# Altium schematic sheet 100_POWER.SchDoc: Power Regulation
size A; Revision: 1; SheetNumber: 1
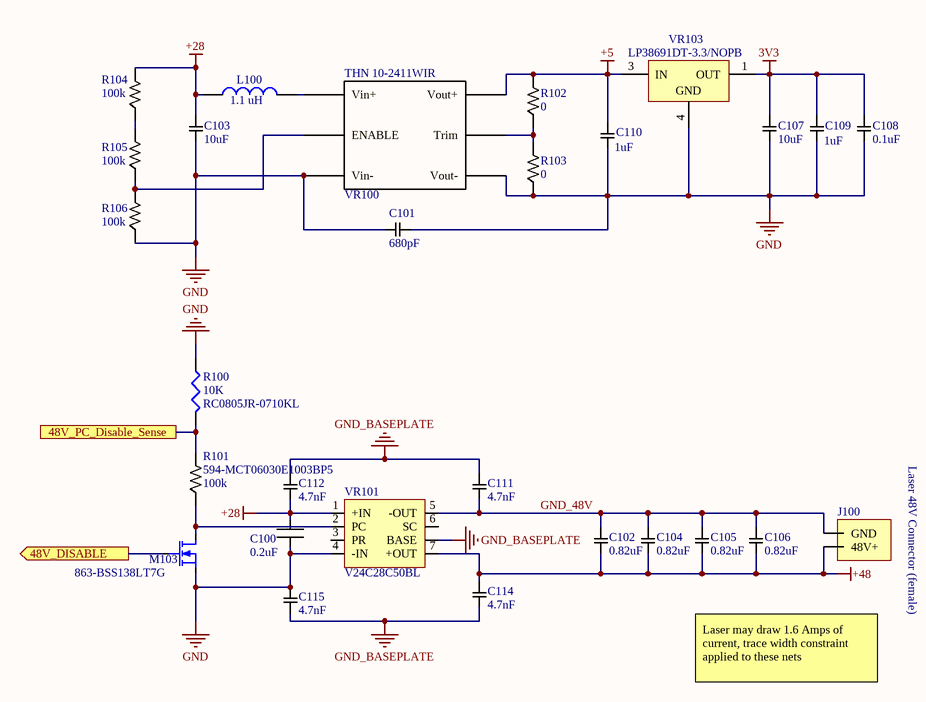
[diagram p0: 100_POWER.SchDoc]

## Parts
C100  value 0.2uF  [CAA572C0G2J204J640LH]  (hidden comment: 0.2uF Capactor, high voltage)
C101  value 680pF  [Imperial1808_CAP]  (hidden comment: 680pF Cap)
C102  value 0.82uF  [IMPERIAL1206_CAPACITOR]  (hidden comment: C1206X824J1RACAUTO)
C103  value 10uF  [Imperial1210_Cap]  (hidden comment: 10uF Capacitor)
C104  value 0.82uF  [IMPERIAL1206_CAPACITOR]  (hidden comment: C1206X824J1RACAUTO)
C105  value 0.82uF  [IMPERIAL1206_CAPACITOR]  (hidden comment: C1206X824J1RACAUTO)
C106  value 0.82uF  [IMPERIAL1206_CAPACITOR]  (hidden comment: C1206X824J1RACAUTO)
C107  value 10uF  [IMPERIAL1206_CAPACITOR]  (hidden comment: C1206X106K8RACAUTO)
C108  value 0.1uF  [IMPERIAL0603_Capacitor]  (hidden comment: 0.1uF Capacitor)
C109  value 1uF  [IMPERIAL0603_Capacitor]  (hidden comment: 1 uF Capacitor)
C110  value 1uF  [IMPERIAL0603_Capacitor]  (hidden comment: 1 uF Capacitor)
C111  value 4.7nF  [IMPERIAL0603_Capacitor]  (hidden comment: 4.7nF Capacitor)
C112  value 4.7nF  [IMPERIAL0603_Capacitor]  (hidden comment: 4.7nF Capacitor)
C114  value 4.7nF  [IMPERIAL0603_Capacitor]  (hidden comment: 4.7nF Capacitor)
C115  value 4.7nF  [IMPERIAL0603_Capacitor]  (hidden comment: 4.7nF Capacitor)
J100  LaserHeader  [MOLEX 2X1 LATCH HEADER]  (value not drawn)
L100  value 1.1 uH  [XAL6020-112ME_]  (hidden comment: 1.1uH Inductor)
M103  Supplier Part Number 1: 863-BSS138LT7G  [SOT95P245X110-3N]  (hidden comment: BSS138LT7G)
R100  RC0805JR-0710KL  value 10K  [Imperial0805_RES]
R101  value 100k  Supplier Part Number 1: 594-MCT06030E1003BP5  [Imperial0603_RES]  (hidden comment: MCT06030E1003BP500)
R102  value 0  [Imperial0603_RES]  (hidden comment: 0 Ohm Link)
R103  value 0  [Imperial0603_RES]  (hidden comment: 0 Ohm Link)
R104  value 100k  [Imperial0603_RES]  (hidden comment: MCT06030E1003BP500)
R105  value 100k  [Imperial0603_RES]  (hidden comment: MCT06030E1003BP500)
R106  value 100k  [Imperial0603_RES]  (hidden comment: MCT06030E1003BP500)
VR100  28 to 5V switching converter  [THN 30-2411WI-A1]  (value not drawn)
VR101  V24C28C50BL  [V24C48C50BL_tht]
VR103  LP38691DT-3.3/NOPB  [NDP0003B_N]

## Ports
48V_DISABLE (out), 48V_PC_Disable_Sense

## Nets
3V3: C107.2 C108.2 C109.2 VR103.1(OUT)
+5: C110.2 R102.1 VR100.3(Vout+) VR103.3(IN)
+28: C100.2 C103.2 C112.1 L100.1 R104.1 VR101.1(+IN)
+48: C102.1 C104.1 C105.1 C106.1 C114.2 J100.1(48V+) VR101.7(+OUT)
GND: C100.1 C101.1 C101.2 C103.1 C107.1 C108.1 C109.1 C110.1 C115.1 M103.2(S) R100.1 R103.2 R106.2 VR100.2(Vin-) VR100.5(Vout-) VR101.4(-IN) VR103.4(GND)
GND_BASEPLATE: C111.2 C112.2 C114.1 C115.2 VR101.BASE
48V_DISABLE: M103.1(G) ; port 48V_DISABLE
48V_PC_Disable_Sense: R100.2 R101.1 ; port 48V_PC_Disable_Sense
GND_48V: C102.2 C104.2 C105.2 C106.2 C111.1 J100.2(GND) VR101.5(-OUT)
NetL100_2: L100.2 VR100.1(Vin+)
NetM103_3: M103.3(D) R101.2 VR101.2(PC)
NetR102_2: R102.2 R103.1 VR100.4(Trim)
NetR104_2: R104.2 R105.1
NetR105_2: R105.2 R106.1 VR100.6(ENABLE)

Not connected (* = marked no-connect by the designer): VR101 3(PR) 6(SC)

## Notes on the sheet
- Laser may draw 1.6 Amps of current, trace width constraint applied to these nets
- (in symbol LaserHeader) Laser 48V Connector (female)

## Library data of the parts
C100 = CAA572C0G2J204J640LH: 0.2uF capacitor, high voltage; Supplier 1: Digi-Key; Supplier Part Number 1: 445-180360-1-ND
C101 = C1808C681KHRACTU: 680pF Cap for EMI suppresion on 5V regulator; Supplier 1: Mouser; Supplier Part Number 1: 80-C1808C681KHR
C102 C104-C106 = C1206X824J1RACAUTO: 0.82 uF Capacitor for creating output capacitance on 48V converter; Manufacturer: KEMET; Manufacturer Part Number: C1206X824J1RACAUTO
C103 = CNA6P1X7R1H106K250AE: 10 uF Capacitor for EMI supression on 5V regulator; Supplier Part Number: C2012X8L1A106K125AE; Supplier 1: Mouser; Supplier Part Number 1: 810-CNA6P1X7R1H106K2
C107 = C1206X106K8RACAUTO: 10 uF Capacitor, non-polar; Manufacturer: KEMET; Manufacturer Part Number: C1206X106K8RACAUTO
C108 = VJ0603Y104MXQPW1BC: 0.1uF Capacitor, Non Polarized Chip Cap; Supplier 1: Mouser; Supplier Part Number 1: 963-LMK107BJ225KK-T
C109 C110 = TMK107BLD105KA-T: Supplier 1: Mouser; Supplier Part Number 1: 963-TMK107BLD105KA-T
C111 C112 C114 C115 = CGA3E2X8R2A472K080AE: 4.7nF soft terminated MLCC capacitor for 48V emi filtering; Supplier 1: Mouser; Supplier Part Number 1: 810-CGA3E2X8R2A472KA
J100 = LaserHeader: 2 pin molex connector for connecting laser to 48Vdc
L100 = XAL6020-112MEB: 1.1uH inductor for EMI suppresion on 5V regulator; Supplier 1: Mouser; Supplier Part Number 1: 994-XAL6020-112MEB
M103 = BSS138LT7G: N-MOSFET for logic level switching; Supplier 1: Mouser
R100 = RC0805JR-0710KL: 10K resistor, 1/8W, 0805 Imperial; Manufacturer_Name: YAGEO (PHYCOMP); Datasheet Link: http://www.yageo.com/documents/recent/PYu-RC_Group_51_RoHS_L_10.pdf; Height: 0.6mm; Manufacturer_Part_Number: RC0805JR-0710KL
R101 R104-R106 = MCT06030E1003BP500: 100 kOhm Resistor; Supplier 1: Mouser
  R104-R106: Supplier Part Number 1: 594-MCT06030E1003BP5
R102 R103 = 0_Ohm_Link: Placeholder 0 Ohm Link.
VR100 = THN 10-2411WIR: 28V to 5V converter; Supplier 1: Digi-Key; Manufacture Part No: THN 10-2411WIR; ComponentLink1Description: Datasheet; ComponentLink1URL: https://www.mouser.com/datasheet/2/687/thn10wir-datasheet-1695877.pdf
VR101 = V24C28C50BL: 28V to 48V converter, 50W; Supplier 1: Mouser; Supplier Part Number 1: 492-V24C48C50BL
VR103 = CMP-0062-00443-4: 3.3V 500mA Low Dropout CMOS Linear Regulators Stable with Ceramic Output Capacitors, 3-pin TO-252, Pb-Free, 75 Rail; Manufacturer: Texas Instruments; CompType: LDO IC; PowerWise: Y; PackageTopMarking: NSUZXYTT*LP38691*DT-3.3; PackageDescription: TO252, Molded, Jedec, 6.8 x 6.10 x 2.30mm Body, 3 Lead, 2.28mm Pitch, Surface Mount; PackageReference: NDP0003B; ComponentLink1Description: Datasheet URL; RoHS: Y; PartNumber: LP38691DT-3.3/NOPB; PinCount: 3; ComponentLink1URL: http://www.ti.com/general/docs/lit/getliterature.tsp?genericPartNumber=LP38691&fileType=pdf; Code_JEDEC: TO-252-AA; High-Reliability: Y